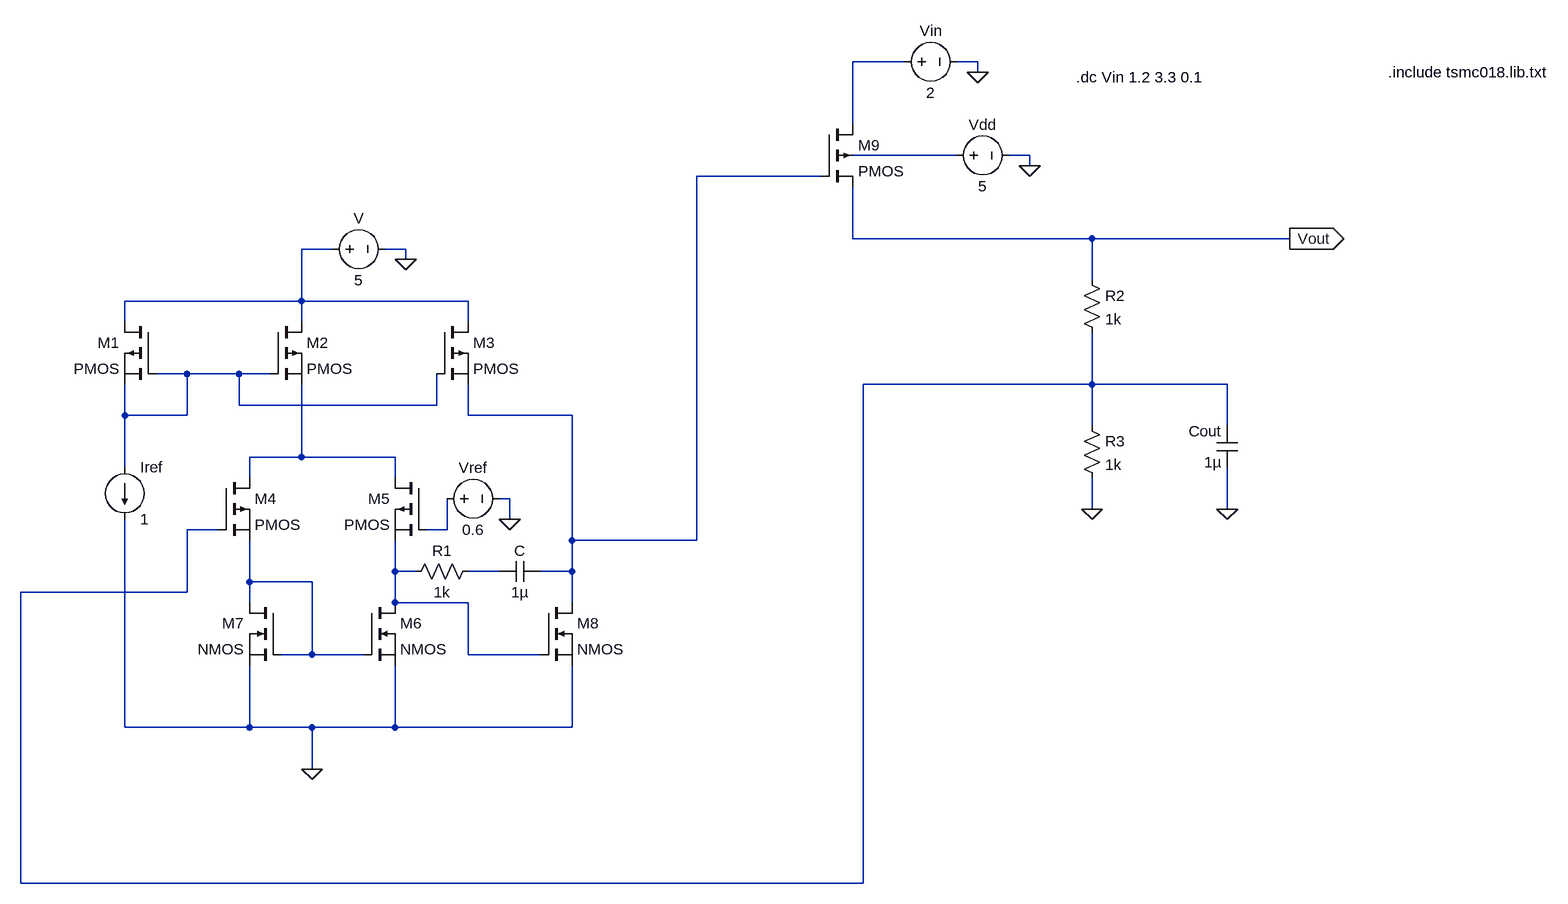
[diagram p0: schematic LDO Design Project.asc]
LDO Design Project.asc, the LTspice schematic file:
Version 4
SHEET 1 2204 964
WIRE 1184 -304 1104 -304
WIRE 1296 -304 1264 -304
WIRE 1296 -288 1296 -304
WIRE 1104 -208 1104 -304
WIRE 1264 -160 1104 -160
WIRE 1376 -160 1344 -160
WIRE 1376 -144 1376 -160
WIRE 1056 -128 864 -128
WIRE 1104 -32 1104 -112
WIRE 1472 -32 1104 -32
WIRE 1776 -32 1472 -32
WIRE 304 -16 256 -16
WIRE 416 -16 384 -16
WIRE 416 0 416 -16
WIRE 1472 32 1472 -32
WIRE 256 64 256 -16
WIRE 256 64 -16 64
WIRE 512 64 256 64
WIRE -16 96 -16 64
WIRE 256 96 256 64
WIRE 512 96 512 64
WIRE 80 176 32 176
WIRE 160 176 80 176
WIRE 208 176 160 176
WIRE 1472 192 1472 112
WIRE 1472 192 1120 192
WIRE 1680 192 1472 192
WIRE 160 224 160 176
WIRE 464 224 464 176
WIRE 464 224 160 224
WIRE -16 240 -16 192
WIRE 80 240 80 176
WIRE 80 240 -16 240
WIRE 512 240 512 192
WIRE 672 240 512 240
WIRE 1472 256 1472 192
WIRE 1680 256 1680 192
WIRE 256 304 256 192
WIRE 256 304 176 304
WIRE 400 304 256 304
WIRE -16 320 -16 240
WIRE 176 336 176 304
WIRE 400 336 400 304
WIRE 576 368 560 368
WIRE 1472 384 1472 336
WIRE 1680 384 1680 320
WIRE 576 400 576 368
WIRE 128 416 80 416
WIRE 480 416 480 368
WIRE 480 416 448 416
WIRE 672 432 672 240
WIRE 864 432 864 -128
WIRE 864 432 672 432
WIRE 400 480 400 432
WIRE 432 480 400 480
WIRE 560 480 512 480
WIRE 672 480 672 432
WIRE 672 480 624 480
WIRE 176 496 176 432
WIRE 272 496 176 496
WIRE 80 512 80 416
WIRE 80 512 -176 512
WIRE 176 528 176 496
WIRE 400 528 400 480
WIRE 512 528 400 528
WIRE 672 528 672 480
WIRE 272 608 272 496
WIRE 272 608 224 608
WIRE 352 608 272 608
WIRE 512 608 512 528
WIRE 624 608 512 608
WIRE -16 720 -16 400
WIRE 176 720 176 624
WIRE 176 720 -16 720
WIRE 272 720 176 720
WIRE 400 720 400 624
WIRE 400 720 272 720
WIRE 672 720 672 624
WIRE 672 720 400 720
WIRE 272 784 272 720
WIRE -176 960 -176 512
WIRE 1120 960 1120 192
WIRE 1120 960 -176 960
FLAG 416 0 0
FLAG 576 400 0
FLAG 272 784 0
FLAG 1296 -288 0
FLAG 1376 -144 0
FLAG 1472 384 0
FLAG 1680 384 0
FLAG 1776 -32 Vout
IOPIN 1776 -32 Out
SYMBOL pmos 32 96 M0
SYMATTR InstName M1
SYMBOL pmos 208 96 R0
SYMATTR InstName M2
SYMBOL pmos 464 96 R0
SYMATTR InstName M3
SYMBOL voltage 288 -16 R270
WINDOW 0 32 56 VTop 2
WINDOW 3 -32 56 VBottom 2
WINDOW 123 0 0 Left 0
WINDOW 39 0 0 Left 0
SYMATTR InstName V
SYMATTR Value 5
SYMBOL current -16 320 R0
WINDOW 123 0 0 Left 0
WINDOW 39 0 0 Left 0
SYMATTR InstName Iref
SYMATTR Value 1
SYMBOL pmos 128 336 R0
SYMATTR InstName M4
SYMBOL pmos 448 336 M0
SYMATTR InstName M5
SYMBOL nmos 352 528 R0
SYMATTR InstName M6
SYMBOL nmos 224 528 M0
SYMATTR InstName M7
SYMBOL nmos 624 528 R0
SYMATTR InstName M8
SYMBOL voltage 464 368 R270
WINDOW 0 32 56 VTop 2
WINDOW 3 -32 56 VBottom 2
WINDOW 123 0 0 Left 0
WINDOW 39 0 0 Left 0
SYMATTR InstName Vref
SYMATTR Value 0.6
SYMBOL res 528 464 R90
WINDOW 0 0 56 VBottom 2
WINDOW 3 32 56 VTop 2
SYMATTR InstName R1
SYMATTR Value 1k
SYMBOL cap 624 464 R90
WINDOW 0 0 32 VBottom 2
WINDOW 3 32 32 VTop 2
SYMATTR InstName C
SYMATTR Value 1µ
SYMBOL pmos4 1056 -208 R0
SYMATTR InstName M9
SYMBOL voltage 1168 -304 R270
WINDOW 0 32 56 VTop 2
WINDOW 3 -32 56 VBottom 2
WINDOW 123 0 0 Left 0
WINDOW 39 0 0 Left 0
SYMATTR InstName Vin
SYMATTR Value 2
SYMBOL voltage 1248 -160 R270
WINDOW 0 32 56 VTop 2
WINDOW 3 -32 56 VBottom 2
WINDOW 123 0 0 Left 0
WINDOW 39 0 0 Left 0
SYMATTR InstName Vdd
SYMATTR Value 5
SYMBOL res 1456 16 R0
SYMATTR InstName R2
SYMATTR Value 1k
SYMBOL res 1456 240 R0
SYMATTR InstName R3
SYMATTR Value 1k
SYMBOL cap 1696 320 R180
WINDOW 0 24 56 Left 2
WINDOW 3 24 8 Left 2
SYMATTR InstName Cout
SYMATTR Value 1µ
TEXT 1928 -288 Left 2 !.include tsmc018.lib.txt
TEXT 1448 -280 Left 2 !.dc Vin 1.2 3.3 0.1

The netlist it stands for:
* LDO Design Project.asc
M1 N004 N005 N005 N005 PMOS
M2 N004 N005 N007 N007 PMOS
M3 N004 N005 N003 N003 PMOS
V N004 0 5
Iref N005 0 1
M4 N007 N006 N011 N011 PMOS
M5 N007 N008 N009 N009 PMOS
M6 N009 N011 0 0 NMOS
M7 N011 N011 0 0 NMOS
M8 N003 N009 0 0 NMOS
Vref N008 0 0.6
R1 N010 N009 1k
C N003 N010 1µ
M9 N001 N003 Vout N002 PMOS
Vin N001 0 2
Vdd N002 0 5
R2 Vout N006 1k
R3 N006 0 1k
Cout 0 N006 1µ
.model NMOS NMOS
.model PMOS PMOS
.lib standard.mos
.include tsmc018.lib.txt
.dc Vin 1.2 3.3 0.1
.backanno
.end